# Altium schematic sheet Battery Level Indicator.SchDoc: BATTERY LEVEL INDICATOR
size B; CompanyName: ENGINEERING & TECHNICAL SERVICES; DrawnBy: C. Kornowski; Engineer: C. Kornowski; Organization: TECHNOLOGY DEVELOPMENT & ENGINEERING CENTER; Address1: 11401 HOOVER ROAD; Address2: MILAN, OH  44846; DocumentNumber: RD17-700*; SheetNumber: 4; PageSetup: Record=PageOptions|CenterHorizontal=True|CenterVertical=True|PrintScale=1.09|XCorrection=1.00|YCorrection=1.00|PrintKind=1|BorderSize=5000000|LeftOffset=0|BottomOffset=0|Orientation=2|PaperLength=1000|PaperWidth=1000|Scale=100|PaperSource=7|PrintQuality=600|MediaType=1|DitherType=10|PaperKind=11x17|PrintScaleMode=1
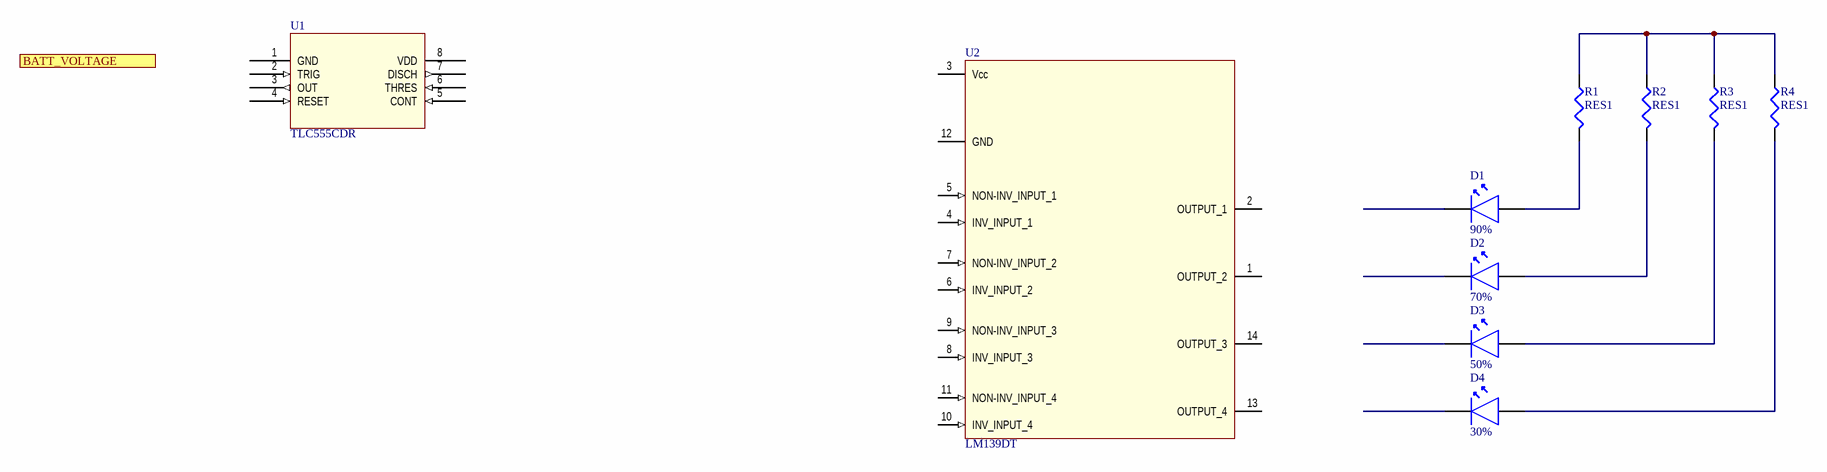
[diagram p0: Battery Level Indicator.SchDoc]

## Parts
D1  90%  [WL-SMRW_1205_GRN]
D2  70%  [WL-SMRW_1205_GRN]
D3  50%  [WL-SMRW_1205_GRN]
D4  30%  [WL-SMRW_1205_GRN]
R1  RES1  [0603]
R2  RES1  [0603]
R3  RES1  [0603]
R4  RES1  [0603]
U1  Manufacturer Part Number 1: TLC555CDR  [D8]  (hidden comment: TLC555CD)
U2  LM139DT  [SO-14]

## Ports
BATT_VOLTAGE

## Nets
NetD1_A: D1.A R1.2
NetD2_A: D2.A R2.2
NetD3_A: D3.A R3.2
NetD4_A: D4.A R4.2
NetR1_1: R1.1 R2.1 R3.1 R4.1

Not connected (* = marked no-connect by the designer): D1 K; D2 K; D3 K; D4 K; U1 1(GND) 2(TRIG) 3(OUT) 4(RESET) 5(CONT) 6(THRES) 7(DISCH) 8(VDD); U2 1(OUTPUT_2) 2(OUTPUT_1) 3(Vcc) 4(INV_INPUT_1) 5(NON-INV_INPUT_1) 6(INV_INPUT_2) 7(NON-INV_INPUT_2) 8(INV_INPUT_3) 9(NON-INV_INPUT_3) 10(INV_INPUT_4) 11(NON-INV_INPUT_4) 12(GND) 13(OUTPUT_4) 14(OUTPUT_3)

## Notes on the sheet
- DCN
- REV
- DESCRIPTION
- REVISION HISTORY
- DATE
- APPROVED
- SIZE
- TITLE
- CAGE CODE
- DWG NO.
- DRAWN BY
- B
- 01HY9
- ENGINEER
- FILE NAME
- SHEET
- PRINTED:
- OF

## Library data of the parts
D1-D4 = LED
R1-R4 = RES1: Resistor; Distributor 1: *; Tolerance: *; Power: *; Distributor Part Number 1: *; Manufacturer 1: *; Manufacturer Part Number 1: *
U1 = TLC555CD: IC OSC SGL TIMER 2.1MHZ 8-SOIC; Manufacturer 1: Texas Instruments; Quiescent Current: 250uA; Current Rating: 250A; Min Supply Voltage: 2V; Max Supply Voltage: 15V; Number of Channels: 1; Max Power Dissipation: 725mW; Operating Supply Current: 360uA; High Level Output Current: -10mA; Low Level Output Current: 100mA; ComponentLink1URL: https://datasheet.ciiva.com/19480/761264-19480039.pdf?src-supplier=Jameco; ComponentLink1Description: https://datasheet.ciiva.com/19480/761264-19480039.pdf?src-supplier=Jameco; ComponentLink2URL: https://datasheet.ciiva.com/14094/tlc555-eng-tds-14094955.pdf?src-supplier=Distrelec; ComponentLink2Description: https://datasheet.ciiva.com/14094/tlc555-eng-tds-14094955.pdf?src-supplier=Distrelec; ComponentLink3URL: https://datasheet.ciiva.com/26795/tlc555cd-26795356.pdf?src-supplier=IIIC; ComponentLink3Description: https://datasheet.ciiva.com/26795/tlc555cd-26795356.pdf?src-supplier=IIIC; ComponentLink4URL: https://datasheet.ciiva.com/1499/tlc555-1499424.pdf?src-supplier=Farnell; ComponentLink4Description: https://datasheet.ciiva.com/1499/tlc555-1499424.pdf?src-supplier=Farnell; ComponentLink5URL: https://datasheet.ciiva.com/1140/1834067-1140135.pdf?src-supplier=Element14; ComponentLink5Description: https://datasheet.ciiva.com/1140/1834067-1140135.pdf?src-supplier=Element14; ComponentLink6URL: https://datasheet.ciiva.com/6668/tlc555-6668327.pdf?src-supplier=Digi-Key; ComponentLink6Description: https://datasheet.ciiva.com/6668/tlc555-6668327.pdf?src-supplier=Digi-Key; ComponentLink7URL: https://datasheet.ciiva.com/14274/tlc555-14274491.pdf?src-supplier=Avnet; ComponentLink7Description: https://datasheet.ciiva.com/14274/tlc555-14274491.pdf?src-supplier=Avnet; ComponentLink8URL: https://datasheet.ciiva.com/26251/tlc555-26251324.pdf?src-supplier=Avnet+Europe; ComponentLink8Description: https://datasheet.ciiva.com/26251/tlc555-26251324.pdf?src-supplier=Avnet+Europe; ComponentLink9URL: https://datasheet.ciiva.com/43491/142786-da-01-en-ic-smd-tlc-555-cdg4-soic8-tid-43491738.pdf?src-supplier=Conrad; ComponentLink9Description: https://datasheet.ciiva.com/43491/142786-da-01-en-ic-smd-tlc-555-cdg4-soic8-tid-43491738.pdf?src-supplier=Conrad; Supplier 1: Digi-Key; Supplier Part Number 1: 296-1336-1-ND; Stock 1: 167836; Pricing 1: 1=0.75000, 10=0.65900, 100=0.50550, 500=0.39964, 1000=0.31971 (USD); RoHS: Yes; Mount: Surface Mount; Case/Package: SOIC; Number of Pins: 8; Weight: 0.002561oz; Min Operating Temperature: -40°C; Max Operating Temperature: 125°C; Frequency: 2.1MHz; Packaging: Cut Tape; Package Quantity: 2500; Number of Timers/Counters: 1; Power Dissipation: 725mW; Termination: SMD/SMT; Length: 4.9mm; Height: 1.58mm; Width: 3.91mm; Radiation Hardening: No; REACH SVHC: No SVHC; Lead Free: Lead Free; ComponentLink10URL: https://datasheet.ciiva.com/14274/tlc555-14274496.pdf?src-supplier=Avnet; ComponentLink10Description: https://datasheet.ciiva.com/14274/tlc555-14274496.pdf?src-supplier=Avnet; ComponentLink11URL: https://datasheet.ciiva.com/26795/tlc555cdr-26795355.pdf?src-supplier=IIIC; ComponentLink11Description: https://datasheet.ciiva.com/26795/tlc555cdr-26795355.pdf?src-supplier=IIIC; ComponentLink12URL: https://datasheet.ciiva.com/15152/getdatasheetpartid-303409-15152646.pdf?src-supplier=Verical; ComponentLink12Description: https://datasheet.ciiva.com/15152/getdatasheetpartid-303409-15152646.pdf?src-supplier=Verical; ComponentLink13URL: https://datasheet.ciiva.com/1140/1834067-1140136.pdf?src-supplier=Element14; ComponentLink13Description: https://datasheet.ciiva.com/1140/1834067-1140136.pdf?src-supplier=Element14; ComponentLink14URL: https://datasheet.ciiva.com/6668/tlc555-6668330.pdf?src-supplier=Digi-Key; ComponentLink14Description: https://datasheet.ciiva.com/6668/tlc555-6668330.pdf?src-supplier=Digi-Key; ComponentLink15URL: https://datasheet.ciiva.com/6668/tlc555-6668331.pdf?src-supplier=Digi-Key; ComponentLink15Description: https://datasheet.ciiva.com/6668/tlc555-6668331.pdf?src-supplier=Digi-Key; ComponentLink16URL: https://datasheet.ciiva.com/26251/tlc555-26251323.pdf?src-supplier=Avnet+Europe; ComponentLink16Description: https://datasheet.ciiva.com/26251/tlc555-26251323.pdf?src-supplier=Avnet+Europe; ComponentLink17URL: https://datasheet.ciiva.com/46395/1834067-46395979.pdf?src-supplier=Element14; ComponentLink17Description: https://datasheet.ciiva.com/46395/1834067-46395979.pdf?src-supplier=Element14; ComponentLink18URL: https://datasheet.ciiva.com/6668/tlc555-6668332.pdf?src-supplier=Digi-Key; ComponentLink18Description: https://datasheet.ciiva.com/6668/tlc555-6668332.pdf?src-supplier=Digi-Key; ComponentLink19URL: https://datasheet.ciiva.com/22697/1834067-22697390.pdf?src-supplier=Element14; ComponentLink19Description: https://datasheet.ciiva.com/22697/1834067-22697390.pdf?src-supplier=Element14
U2 = LM139DT: IC COMP QUAD LOW PWR SO-14; Manufacturer 1: STMicroelectronics; Voltage Gain: 106.02dB; Min Supply Voltage: 2V; Max Supply Voltage: 32V; Min Dual Supply Voltage: 1V; Max Dual Supply Voltage: 16V; Number of Elements: 4; Nominal Supply Current: 2mA; Max Power Dissipation: 830mW; Input Offset Voltage (Vos): 5mV; Input Bias Current: 250nA; Output Current: 16mA; Response Time: 1.3us; Output Type: TTL; Supplier 1: Digi-Key; Supplier Part Number 1: 497-6987-1-ND; Stock 1: 29876; Pricing 1: 1=0.73000, 10=0.64300, 100=0.49300, 500=0.38976, 1000=0.31181 (USD); RoHS: Yes; Mount: Surface Mount; Case/Package: SOIC; Number of Pins: 14; Min Operating Temperature: -55°C; Max Operating Temperature: 125°C; Package Quantity: 1; Packaging: Tape and Reel; Quiescent Current: 2mA; Max Input Current: 250nA; Max Supply Current: 2mA; Number of Channels: 4; Type: General Purpose; Radiation Hardening: No; Lead Free: Lead Free; ComponentLink1URL: https://datasheet.ciiva.com/26859/lm139dt-26859358.pdf?src-supplier=IIIC; ComponentLink1Description: https://datasheet.ciiva.com/26859/lm139dt-26859358.pdf?src-supplier=IIIC; ComponentLink2URL: https://datasheet.ciiva.com/1828/cd00000460-1828646.pdf?src-supplier=Digi-Key; ComponentLink2Description: https://datasheet.ciiva.com/1828/cd00000460-1828646.pdf?src-supplier=Digi-Key; ComponentLink3URL: https://datasheet.ciiva.com/1828/cd00000460-1828647.pdf?src-supplier=Digi-Key; ComponentLink3Description: https://datasheet.ciiva.com/1828/cd00000460-1828647.pdf?src-supplier=Digi-Key; ComponentLink4URL: https://datasheet.ciiva.com/1828/cd00000460-1828648.pdf?src-supplier=Digi-Key; ComponentLink4Description: https://datasheet.ciiva.com/1828/cd00000460-1828648.pdf?src-supplier=Digi-Key; ComponentLink5URL: https://datasheet.ciiva.com/4463/cd00000460-4463468.pdf?src-supplier=Mouser; ComponentLink5Description: https://datasheet.ciiva.com/4463/cd00000460-4463468.pdf?src-supplier=Mouser; ComponentLink6URL: https://datasheet.ciiva.com/41459/001185731-da-01-en-ic-comparator-quad-l-lm139dt-soic-14-stm-41459927.pdf?src-supplier=Conrad; ComponentLink6Description: https://datasheet.ciiva.com/41459/001185731-da-01-en-ic-comparator-quad-l-lm139dt-soic-14-stm-41459927.pdf?src-supplier=Conrad; Manufacturer Part Number 1: LM139DT